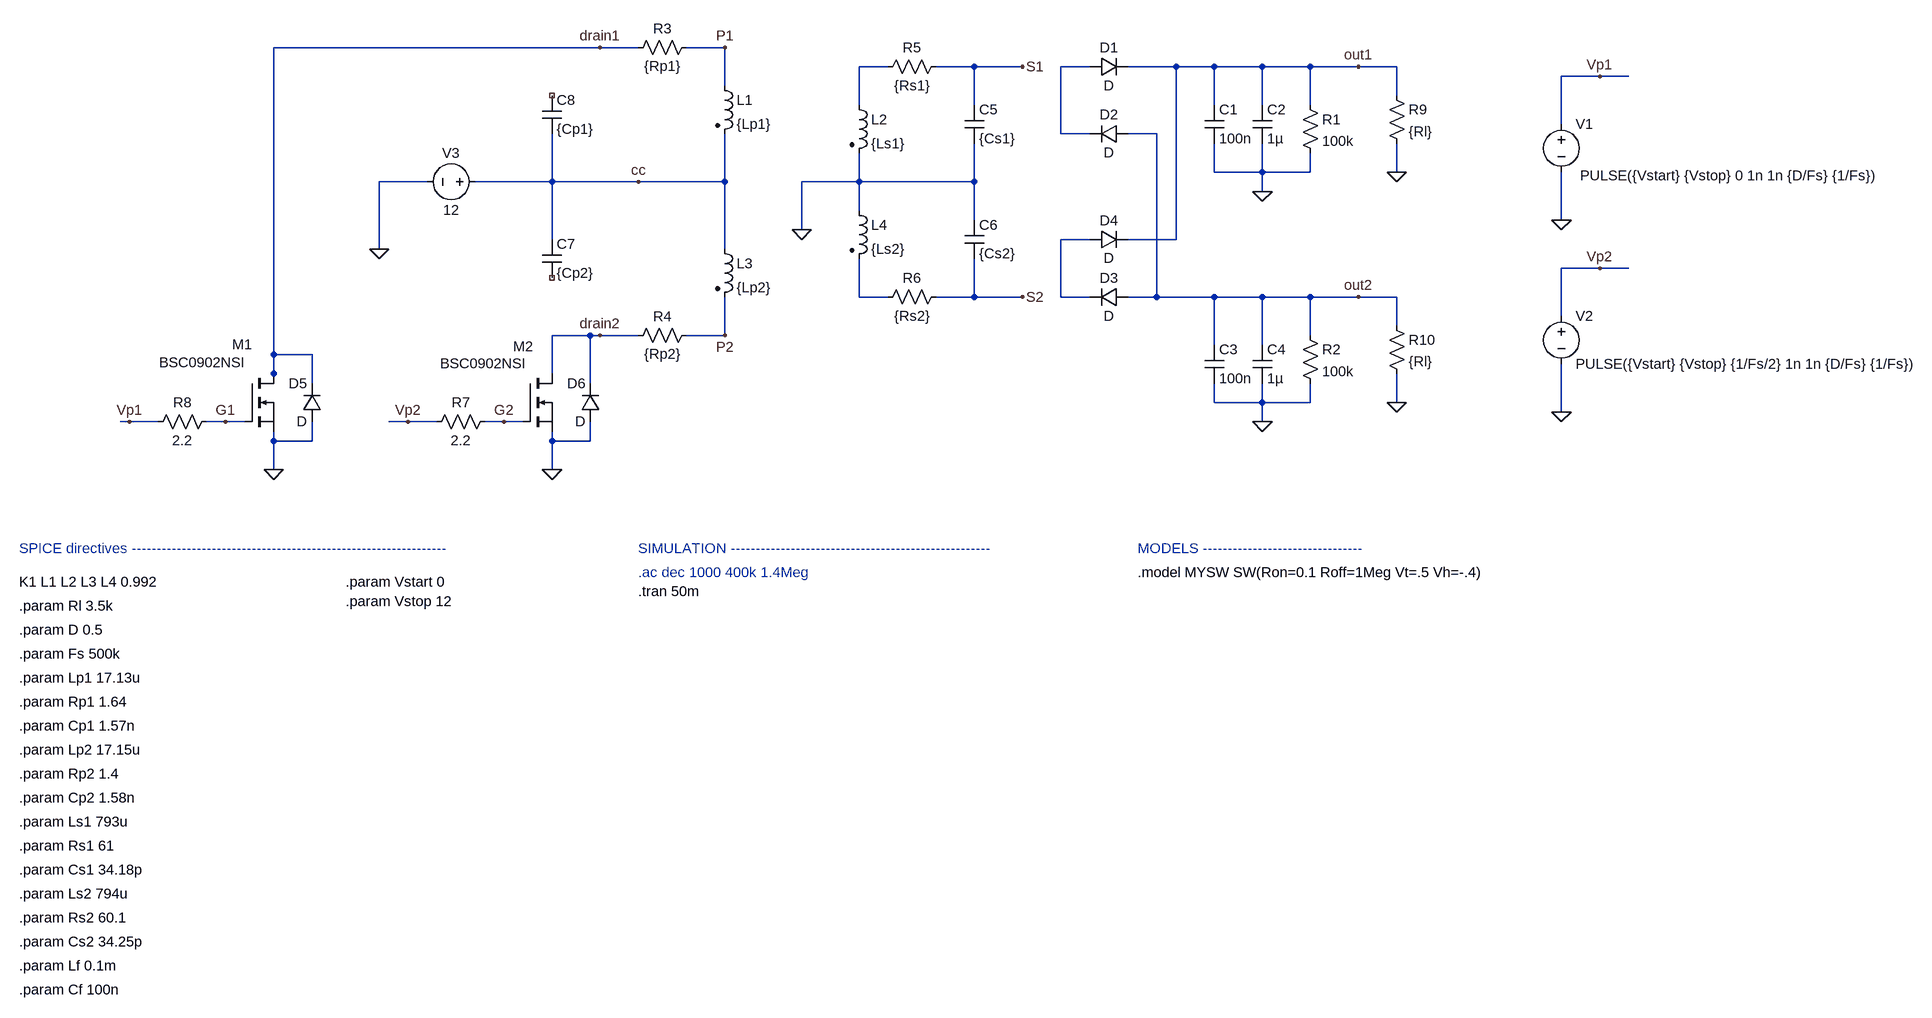
[diagram p0: schematic 4-square_wav_gen_bps.asc]
4-square_wav_gen_bps.asc, the LTspice schematic file:
Version 4
SHEET 1 2872 2276
WIRE 240 528 -304 528
WIRE 304 528 240 528
WIRE 448 528 384 528
WIRE 720 560 672 560
WIRE 864 560 800 560
WIRE 944 560 864 560
WIRE 1056 560 1008 560
WIRE 1200 560 1120 560
WIRE 1264 560 1200 560
WIRE 1344 560 1264 560
WIRE 1424 560 1344 560
WIRE 1504 560 1424 560
WIRE 1568 560 1504 560
WIRE 2128 576 2064 576
WIRE 2176 576 2128 576
WIRE 448 592 448 528
WIRE 1568 608 1568 560
WIRE 672 624 672 560
WIRE 864 624 864 560
WIRE 1264 624 1264 560
WIRE 1344 624 1344 560
WIRE 1424 624 1424 560
WIRE 2064 656 2064 576
WIRE 1008 672 1008 560
WIRE 1056 672 1008 672
WIRE 1168 672 1120 672
WIRE 1264 736 1264 688
WIRE 1344 736 1344 688
WIRE 1344 736 1264 736
WIRE 1424 736 1424 704
WIRE 1424 736 1344 736
WIRE 1568 736 1568 688
WIRE -48 752 -128 752
WIRE 160 752 160 672
WIRE 160 752 32 752
WIRE 304 752 160 752
WIRE 448 752 448 672
WIRE 448 752 304 752
WIRE 672 752 672 704
WIRE 672 752 576 752
WIRE 864 752 864 688
WIRE 864 752 672 752
WIRE 1344 768 1344 736
WIRE 672 800 672 752
WIRE 864 816 864 752
WIRE 2064 816 2064 736
WIRE 576 832 576 752
WIRE 160 848 160 752
WIRE 1056 848 1008 848
WIRE 1200 848 1200 560
WIRE 1200 848 1120 848
WIRE -128 864 -128 752
WIRE 448 864 448 752
WIRE 2128 896 2064 896
WIRE 2176 896 2128 896
WIRE 672 944 672 880
WIRE 720 944 672 944
WIRE 864 944 864 880
WIRE 864 944 800 944
WIRE 944 944 864 944
WIRE 1008 944 1008 848
WIRE 1056 944 1008 944
WIRE 1168 944 1168 672
WIRE 1168 944 1120 944
WIRE 1264 944 1168 944
WIRE 1344 944 1264 944
WIRE 1424 944 1344 944
WIRE 1504 944 1424 944
WIRE 1568 944 1504 944
WIRE 2064 976 2064 896
WIRE 1568 992 1568 944
WIRE 224 1008 160 1008
WIRE 240 1008 224 1008
WIRE 304 1008 240 1008
WIRE 448 1008 448 944
WIRE 448 1008 384 1008
WIRE 1424 1008 1424 944
WIRE 1264 1024 1264 944
WIRE 1344 1024 1344 944
WIRE -304 1040 -304 528
WIRE -240 1040 -304 1040
WIRE -304 1072 -304 1040
WIRE 160 1072 160 1008
WIRE -304 1088 -304 1072
WIRE -240 1088 -240 1040
WIRE 224 1088 224 1008
WIRE 1264 1120 1264 1088
WIRE 1344 1120 1344 1088
WIRE 1344 1120 1264 1120
WIRE 1424 1120 1424 1088
WIRE 1424 1120 1344 1120
WIRE 1568 1120 1568 1072
WIRE 2064 1136 2064 1056
WIRE -544 1152 -560 1152
WIRE -496 1152 -544 1152
WIRE -384 1152 -416 1152
WIRE -352 1152 -384 1152
WIRE -80 1152 -112 1152
WIRE -32 1152 -80 1152
WIRE 80 1152 48 1152
WIRE 112 1152 80 1152
WIRE 1344 1152 1344 1120
WIRE -304 1184 -304 1168
WIRE -240 1184 -240 1152
WIRE -240 1184 -304 1184
WIRE 160 1184 160 1168
WIRE 224 1184 224 1152
WIRE 224 1184 160 1184
WIRE -304 1232 -304 1184
WIRE 160 1232 160 1184
FLAG 448 528 P1
FLAG 448 1008 P2
FLAG 1344 1152 0
FLAG 1344 768 0
FLAG 576 832 0
FLAG 2064 816 0
FLAG 2064 1136 0
FLAG 2128 576 Vp1
FLAG 2128 896 Vp2
FLAG -304 1232 0
FLAG 160 1232 0
FLAG -128 864 0
FLAG -544 1152 Vp1
FLAG -80 1152 Vp2
FLAG 240 528 drain1
FLAG 240 1008 drain2
FLAG -384 1152 G1
FLAG 80 1152 G2
FLAG 304 752 cc
FLAG 1568 736 0
FLAG 1568 1120 0
FLAG 944 560 S1
FLAG 944 944 S2
FLAG 1504 560 out1
FLAG 1504 944 out2
SYMBOL ind2 432 576 R0
SYMATTR InstName L1
SYMATTR Value {Lp1}
SYMATTR Type ind
SYMBOL ind2 656 608 R0
SYMATTR InstName L2
SYMATTR Value {Ls1}
SYMATTR Type ind
SYMBOL ind2 432 848 R0
SYMATTR InstName L3
SYMATTR Value {Lp2}
SYMATTR Type ind
SYMBOL ind2 656 784 R0
SYMATTR InstName L4
SYMATTR Value {Ls2}
SYMATTR Type ind
SYMBOL diode 1056 576 R270
WINDOW 0 32 32 VTop 2
WINDOW 3 0 32 VBottom 2
SYMATTR InstName D1
SYMBOL diode 1120 656 R90
WINDOW 0 0 32 VBottom 2
WINDOW 3 32 32 VTop 2
SYMATTR InstName D2
SYMBOL diode 1120 928 R90
WINDOW 0 0 32 VBottom 2
WINDOW 3 32 32 VTop 2
SYMATTR InstName D3
SYMBOL diode 1056 864 R270
WINDOW 0 32 32 VTop 2
WINDOW 3 0 32 VBottom 2
SYMATTR InstName D4
SYMBOL cap 1248 624 R0
SYMATTR InstName C1
SYMATTR Value 100n
SYMBOL cap 1328 624 R0
SYMATTR InstName C2
SYMATTR Value 1µ
SYMBOL cap 1248 1024 R0
SYMATTR InstName C3
SYMATTR Value 100n
SYMBOL cap 1328 1024 R0
SYMATTR InstName C4
SYMATTR Value 1µ
SYMBOL res 1408 608 R0
SYMATTR InstName R1
SYMATTR Value 100k
SYMBOL res 1408 992 R0
SYMATTR InstName R2
SYMATTR Value 100k
SYMBOL res 400 512 R90
WINDOW 0 0 56 VBottom 2
WINDOW 3 32 56 VTop 2
SYMATTR InstName R3
SYMATTR Value {Rp1}
SYMBOL res 400 992 R90
WINDOW 0 0 56 VBottom 2
WINDOW 3 32 56 VTop 2
SYMATTR InstName R4
SYMATTR Value {Rp2}
SYMBOL res 816 544 R90
WINDOW 0 0 56 VBottom 2
WINDOW 3 32 56 VTop 2
SYMATTR InstName R5
SYMATTR Value {Rs1}
SYMBOL res 816 928 R90
WINDOW 0 0 56 VBottom 2
WINDOW 3 32 56 VTop 2
SYMATTR InstName R6
SYMATTR Value {Rs2}
SYMBOL cap 848 624 R0
SYMATTR InstName C5
SYMATTR Value {Cs1}
SYMBOL cap 848 816 R0
SYMATTR InstName C6
SYMATTR Value {Cs2}
SYMBOL voltage 2064 640 R0
WINDOW 3 31 102 Left 2
WINDOW 123 0 0 Left 0
WINDOW 39 24 46 Left 2
SYMATTR Value PULSE({Vstart} {Vstop} 0 1n 1n {D/Fs} {1/Fs})
SYMATTR InstName V1
SYMBOL voltage 2064 960 R0
WINDOW 123 0 0 Left 0
WINDOW 39 24 126 Left 2
SYMATTR InstName V2
SYMATTR Value PULSE({Vstart} {Vstop} {1/Fs/2} 1n 1n {D/Fs} {1/Fs})
SYMBOL voltage 48 752 R90
WINDOW 0 -32 56 VBottom 2
WINDOW 3 32 56 VTop 2
WINDOW 123 0 0 Left 0
WINDOW 39 0 0 Left 0
SYMATTR InstName V3
SYMATTR Value 12
SYMBOL nmos -352 1072 R0
WINDOW 0 -21 -49 Left 2
WINDOW 3 -143 -19 Left 2
SYMATTR InstName M1
SYMATTR Value BSC0902NSI
SYMBOL nmos 112 1072 R0
WINDOW 0 -17 -45 Left 2
WINDOW 3 -138 -17 Left 2
SYMATTR InstName M2
SYMATTR Value BSC0902NSI
SYMBOL res 64 1136 R90
WINDOW 0 0 56 VBottom 2
WINDOW 3 32 56 VTop 2
SYMATTR InstName R7
SYMATTR Value 2.2
SYMBOL res -400 1136 R90
WINDOW 0 0 56 VBottom 2
WINDOW 3 32 56 VTop 2
SYMATTR InstName R8
SYMATTR Value 2.2
SYMBOL cap 144 848 R0
SYMATTR InstName C7
SYMATTR Value {Cp2}
SYMBOL cap 144 608 R0
SYMATTR InstName C8
SYMATTR Value {Cp1}
SYMBOL res 1552 592 R0
SYMATTR InstName R9
SYMATTR Value {Rl}
SYMBOL res 1552 976 R0
SYMATTR InstName R10
SYMATTR Value {Rl}
SYMBOL diode -224 1152 R180
WINDOW 0 24 64 Left 2
WINDOW 3 24 0 Left 2
SYMATTR InstName D5
SYMBOL diode 240 1152 R180
WINDOW 0 24 64 Left 2
WINDOW 3 24 0 Left 2
SYMATTR InstName D6
TEXT -728 1520 Left 2 ;SPICE directives ---------------------------------------------------------------
TEXT 304 1560 Left 2 ;.ac dec 1000 400k 1.4Meg
TEXT 304 1520 Left 2 ;SIMULATION ----------------------------------------------------
TEXT 1136 1560 Left 2 !.model MYSW SW(Ron=0.1 Roff=1Meg Vt=.5 Vh=-.4)
TEXT 1136 1520 Left 2 ;MODELS --------------------------------
TEXT 304 1592 Left 2 !.tran 50m
TEXT -728 1576 Left 2 !K1 L1 L2 L3 L4 0.992
TEXT -728 1736 Left 2 !.param Lp1 17.13u
TEXT -728 1816 Left 2 !.param Cp1 1.57n
TEXT -728 1776 Left 2 !.param Rp1 1.64
TEXT -728 1856 Left 2 !.param Lp2 17.15u
TEXT -728 1936 Left 2 !.param Cp2 1.58n
TEXT -728 1896 Left 2 !.param Rp2 1.4
TEXT -728 1976 Left 2 !.param Ls1 793u
TEXT -728 2056 Left 2 !.param Cs1 34.18p
TEXT -728 2016 Left 2 !.param Rs1 61
TEXT -728 2096 Left 2 !.param Ls2 794u
TEXT -728 2176 Left 2 !.param Cs2 34.25p
TEXT -728 2136 Left 2 !.param Rs2 60.1
TEXT -728 1696 Left 2 !.param Fs 500k
TEXT -728 1656 Left 2 !.param D 0.5
TEXT -728 1616 Left 2 !.param Rl 3.5k
TEXT -728 2216 Left 2 !.param Lf 0.1m
TEXT -728 2256 Left 2 !.param Cf 100n
TEXT -184 1576 Left 2 !.param Vstart 0
TEXT -184 1608 Left 2 !.param Vstop 12

The netlist it stands for:
* 4-square_wav_gen_bps.asc
L1 P1 cc {Lp1}
L2 N001 0 {Ls1}
L3 cc P2 {Lp2}
L4 0 N004 {Ls2}
D1 N002 out1 D
D2 out2 N002 D
D3 out2 N003 D
D4 N003 out1 D
C1 out1 0 100n
C2 out1 0 1µ
C3 out2 0 100n
C4 out2 0 1µ
R1 out1 0 100k
R2 out2 0 100k
R3 P1 drain1 {Rp1}
R4 P2 drain2 {Rp2}
R5 S1 N001 {Rs1}
R6 S2 N004 {Rs2}
C5 S1 0 {Cs1}
C6 0 S2 {Cs2}
V1 Vp1 0 PULSE({Vstart} {Vstop} 0 1n 1n {D/Fs} {1/Fs})
V2 Vp2 0 PULSE({Vstart} {Vstop} {1/Fs/2} 1n 1n {D/Fs} {1/Fs})
V3 cc 0 12
M1 drain1 G1 0 0 BSC0902NSI
M2 drain2 G2 0 0 BSC0902NSI
R7 G2 Vp2 2.2
R8 G1 Vp1 2.2
C7 cc NC_01 {Cp2}
C8 NC_02 cc {Cp1}
R9 out1 0 {Rl}
R10 out2 0 {Rl}
D5 0 drain1 D
D6 0 drain2 D
.model D D
.lib standard.dio
.model NMOS NMOS
.model PMOS PMOS
.lib standard.mos
* SPICE directives ---------------------------------------------------------------
* .ac dec 1000 400k 1.4Meg
* SIMULATION ----------------------------------------------------
.model MYSW SW(Ron=0.1 Roff=1Meg Vt=.5 Vh=-.4)
* MODELS --------------------------------
.tran 50m
K1 L1 L2 L3 L4 0.992
.param Lp1 17.13u
.param Cp1 1.57n
.param Rp1 1.64
.param Lp2 17.15u
.param Cp2 1.58n
.param Rp2 1.4
.param Ls1 793u
.param Cs1 34.18p
.param Rs1 61
.param Ls2 794u
.param Cs2 34.25p
.param Rs2 60.1
.param Fs 500k
.param D 0.5
.param Rl 3.5k
.param Lf 0.1m
.param Cf 100n
.param Vstart 0
.param Vstop 12
.backanno
.end